# EAGLE schematic DUINOMITE-eMEGA_Rev_B1 (EAGLE 4.16)
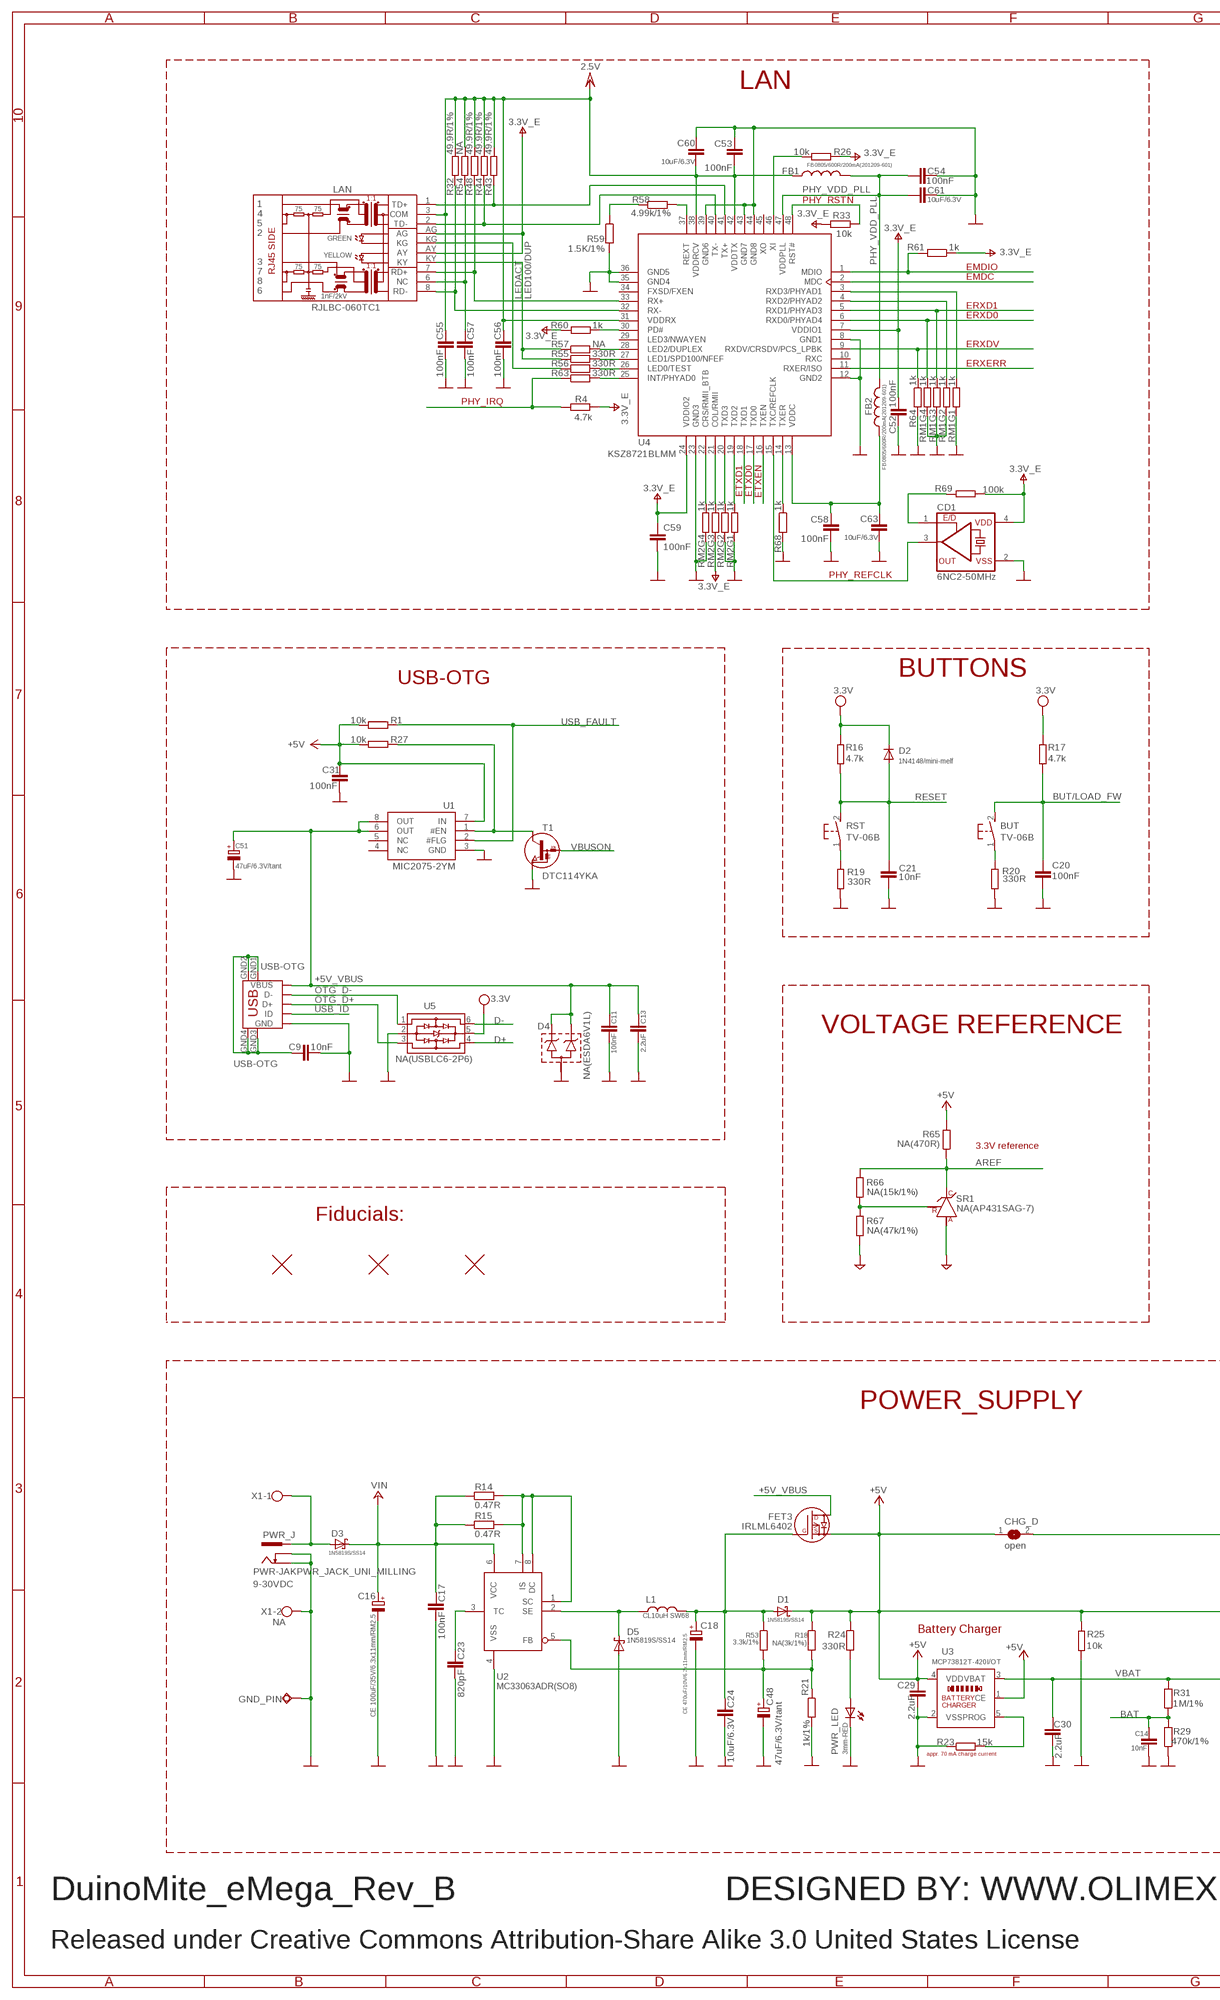
[diagram p0: schematic, sheet 1, part 1 of 2]
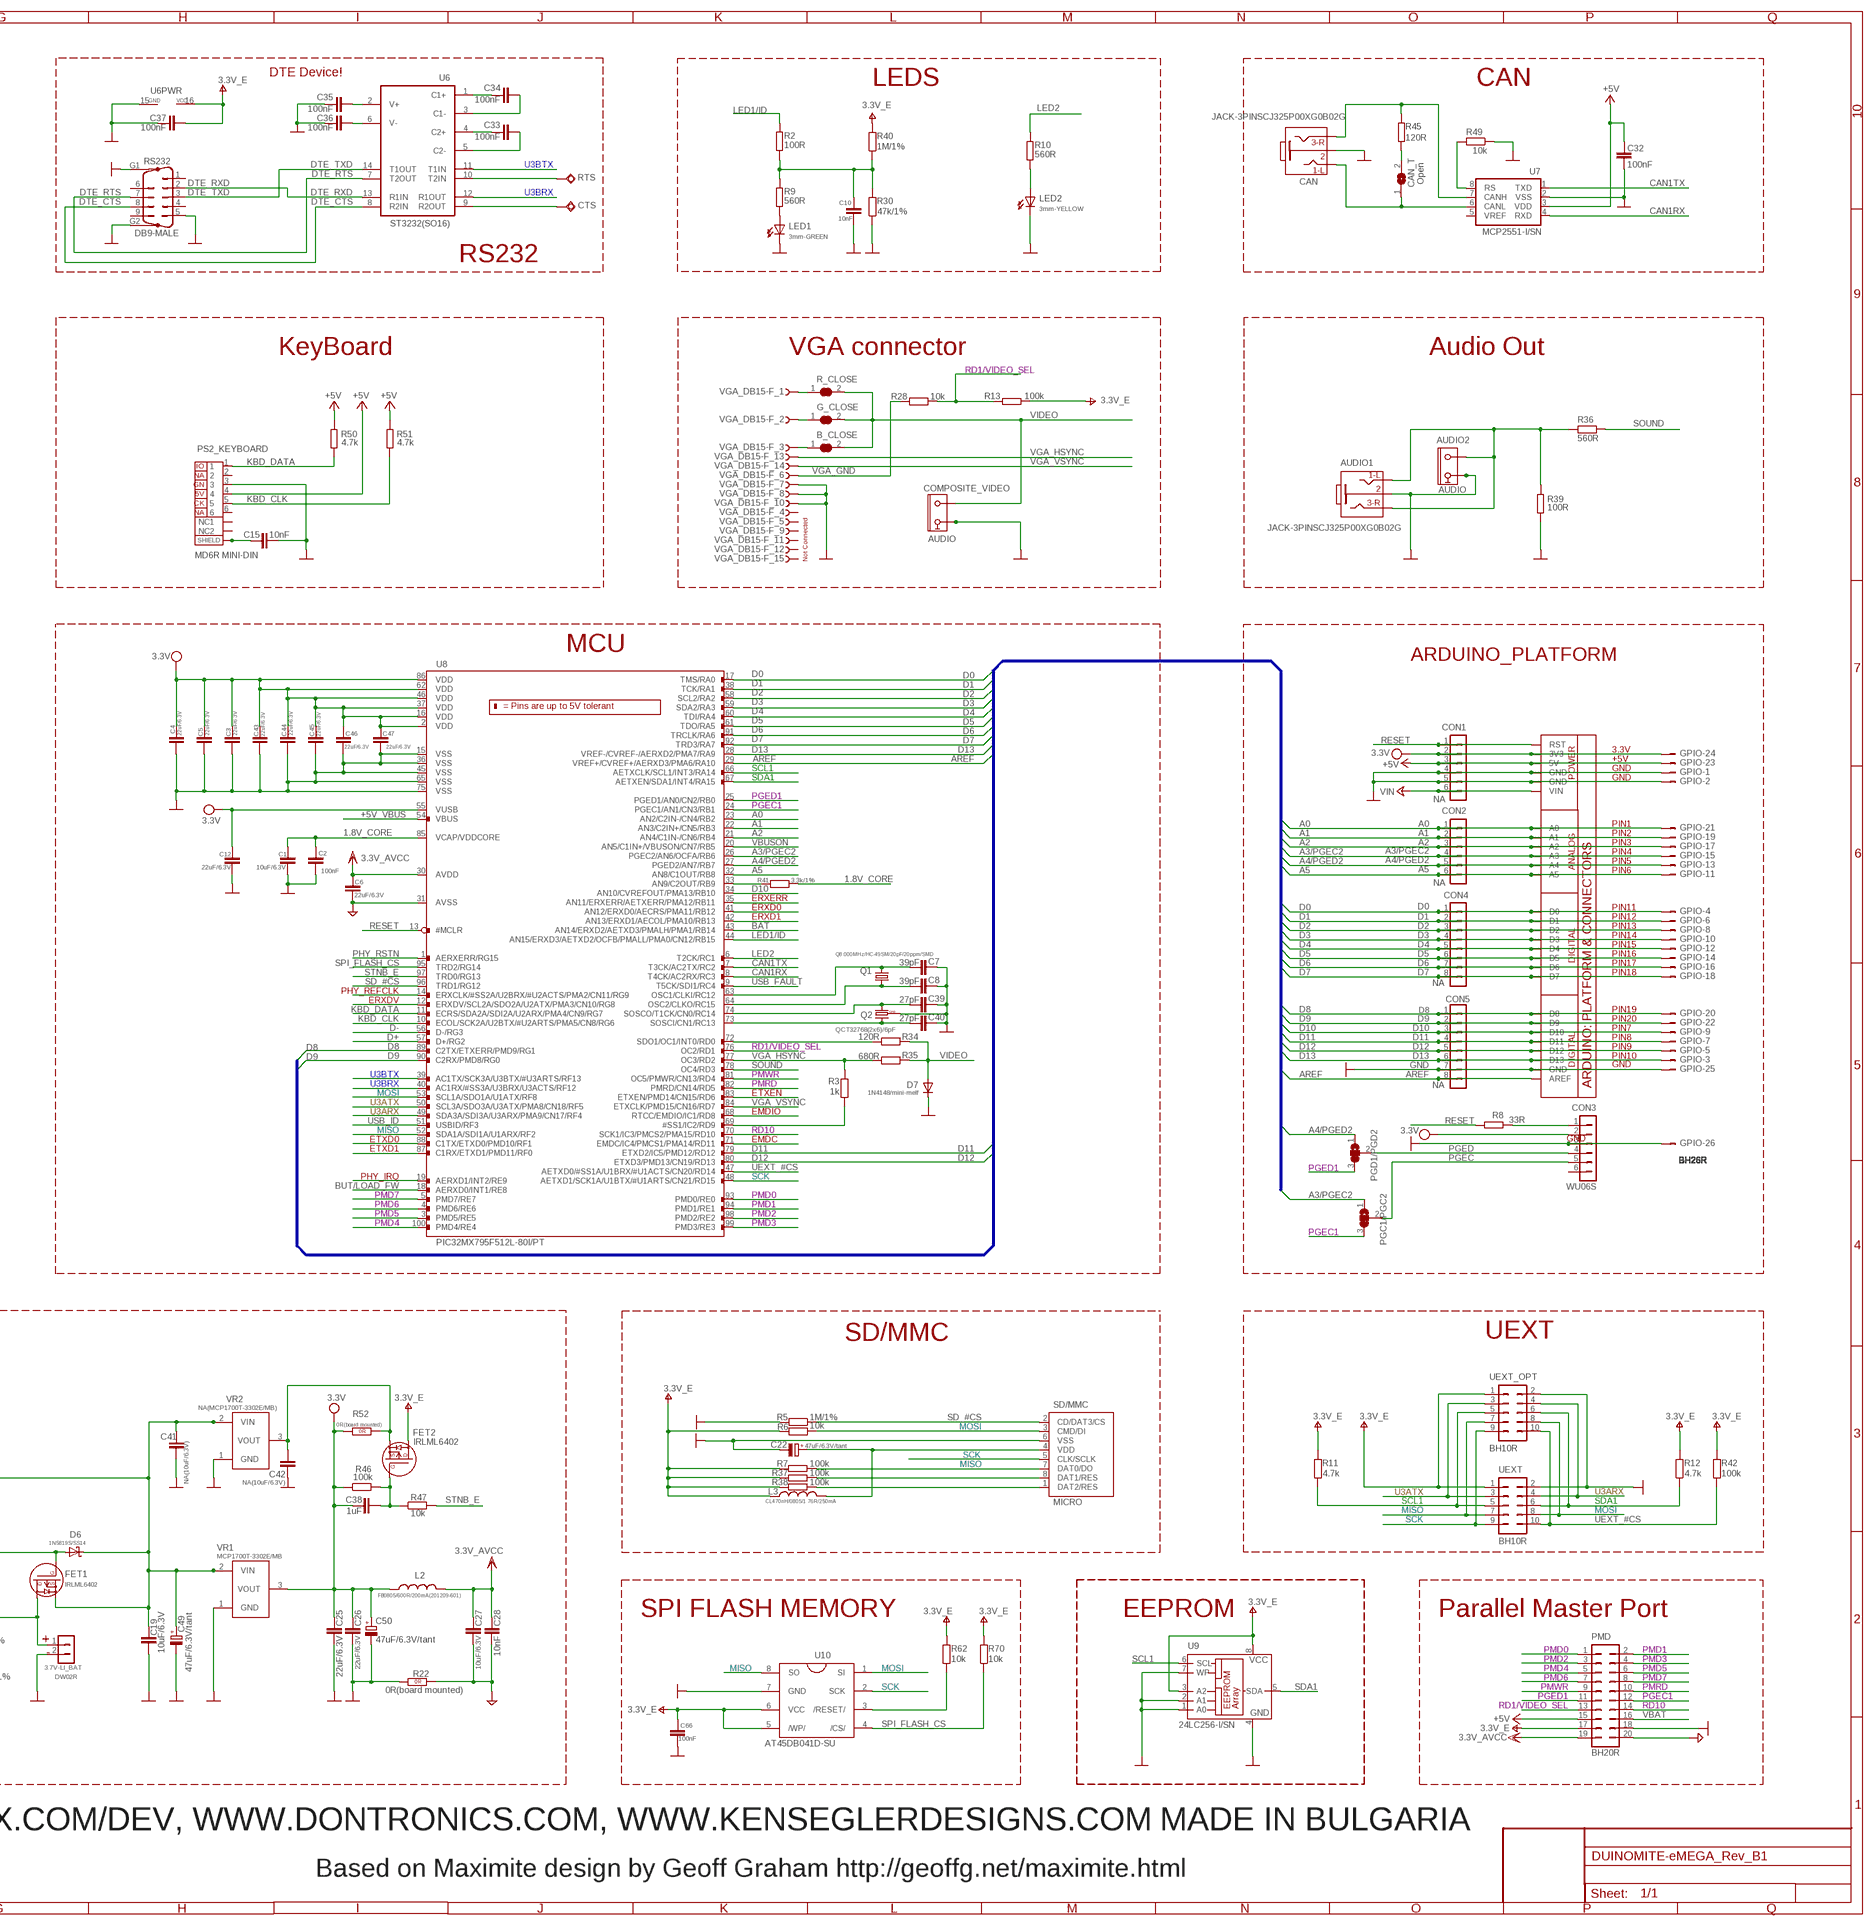
[diagram p1: schematic, sheet 1, part 2 of 2]

## Parts
3.7V-LI_BAT  DW02R  CON2DW02R  [DW02R]
AUDIO1  JACK-3PINSCJ325P00XG0B02G  [PHONE_JACK-SMD]
AUDIO2  AUDIO  VIDEO_CINCH  [VIDEO_CINCH]
B_CLOSE  SJSJ_1_SMALLER_CLOSE  [SJ_1_SMALLER_CLOSE]
BUT  TV-06B  31-XX  [B3F-31XX]
C1  10uF/6.3V  C-EUC0603_DWS  [C0603_DWS]
C2  100nF  C-EUC0603_DWS  [C0603_DWS]
C3  22uF/6.3V  C-EUC0603_DWS  [C0603_DWS]
C4  22uF/6.3V  C-EUC0603_DWS  [C0603_DWS]
C5  22uF/6.3V  C-EUC0603_DWS  [C0603_DWS]
C6  22uF/6.3V  C-EUC0603_DWS  [C0603_DWS]
C7  39pF  C-EUC0603_DWS  [C0603_DWS]
C8  39pF  C-EUC0603_DWS  [C0603_DWS]
C9  10nF  C-EUC0603_DWS  [C0603_DWS]
C10  10nF  C-EUC0603_DWS  [C0603_DWS]
C11  100nF  C-EUC0603_DWS  [C0603_DWS]
C12  22uF/6.3V  C-EUC0603_DWS  [C0603_DWS]
C13  2.2uF  C-EUC0603_DWS  [C0603_DWS]
C14  10nF  C-EUC0603_DWS  [C0603_DWS]
C15  10nF  C-EUC0603_DWS  [C0603_DWS]
C16  CE 100uF/35V/6.3x11mm/RM2.5  CPOL-EUE2.5-6.3  [E2,5-6,3]
C17  100nF  C-EUC0603_DWS  [C0603_DWS]
C18  CE 470uF/10V/6.3x11mm/RM2.5  CPOL-EUE2.5-6.3  [E2,5-6,3]
C19  10uF/6.3V  C-EUC0603_DWS  [C0603_DWS]
C20  100nF  C-EUC0603_DWS  [C0603_DWS]
C21  10nF  C-EUC0603_DWS  [C0603_DWS]
C22  47uF/6.3V/tant  CPOL-EUCT3528  [CT3528]
C23  820pF  C-EUC0603_DWS  [C0603_DWS]
C24  10uF/6.3V  C-EUC0603_DWS  [C0603_DWS]
C25  22uF/6.3V  C-EUC0603_DWS  [C0603_DWS]
C26  22uF/6.3V  C-EUC0603_DWS  [C0603_DWS]
C27  10uF/6.3V  C-EUC0603_DWS  [C0603_DWS]
C28  10nF  C-EUC0603_DWS  [C0603_DWS]
C29  2.2uF  C-EUC0603_DWS  [C0603_DWS]
C30  2.2uF  C-EUC0603_DWS  [C0603_DWS]
C31  100nF  C-EUC0603_DWS  [C0603_DWS]
C32  100nF  C-EUC0603_DWS  [C0603_DWS]
C33  100nF  C-EUC0603_DWS  [C0603_DWS]
C34  100nF  C-EUC0603_DWS  [C0603_DWS]
C35  100nF  C-EUC0603_DWS  [C0603_DWS]
C36  100nF  C-EUC0603_DWS  [C0603_DWS]
C37  100nF  C-EUC0603_DWS  [C0603_DWS]
C38  1uF  C-EUC0603_DWS  [C0603_DWS]
C39  27pF  C-EUC0603_DWS  [C0603_DWS]
C40  27pF  C-EUC0603_DWS  [C0603_DWS]
C41  NA(10uF/6.3V)  C-EUC0603_DWS_NA  [C0603_DWS_NA]
C42  NA(10uF/6.3V)  C-EUC0603_DWS_NA  [C0603_DWS_NA]
C43  22uF/6.3V  C-EUC0603_DWS  [C0603_DWS]
C44  22uF/6.3V  C-EUC0603_DWS  [C0603_DWS]
C45  22uF/6.3V  C-EUC0603_DWS  [C0603_DWS]
C46  22uF/6.3V  C-EUC0603_DWS  [C0603_DWS]
C47  22uF/6.3V  C-EUC0603_DWS  [C0603_DWS]
C48  47uF/6.3V/tant  CPOL-EUCT3528  [CT3528]
C49  47uF/6.3V/tant  CPOL-EUCT3528  [CT3528]
C50  47uF/6.3V/tant  CPOL-EUCT3528  [CT3528]
C51  47uF/6.3V/tant  CPOL-EUCT3528  [CT3528]
C52  100nF  C-EUC0603_DWS  [C0603_DWS]
C53  100nF  C-EUC0603_DWS  [C0603_DWS]
C54  100nF  C-EUC0603_DWS  [C0603_DWS]
C55  100nF  C-EUC0603_DWS  [C0603_DWS]
C56  100nF  C-EUC0603_DWS  [C0603_DWS]
C57  100nF  C-EUC0603_DWS  [C0603_DWS]
C58  100nF  C-EUC0603_DWS  [C0603_DWS]
C59  100nF  C-EUC0603_DWS  [C0603_DWS]
C60  10uF/6.3V  C-EUC0603_DWS  [C0603_DWS]
C61  10uF/6.3V  C-EUC0603_DWS  [C0603_DWS]
C63  10uF/6.3V  C-EUC0603_DWS  [C0603_DWS]
C66  100nF  C-EUC0603_DWS  [C0603_DWS]
CAN  JACK-3PINSCJ325P00XG0B02G  [PHONE_JACK-SMD]
CAN_T  Open  SJ  [SJ]
CD1  6NC2-50MHz  6NC2_CLOCK_DRIVER  [7X5MM_CLOCK_DRIVER]
CHG_D  open  SJ  [SJ]
COMPOSITE_VIDEO  AUDIO  VIDEO_CINCH  [VIDEO_CINCH]
CON1  NA  CON6PN1X6  [PN1X6]
CON2  NA  CON6PN1X6  [PN1X6]
CON3  WU06S  CON6  [CON1.27MM-6-SMALL_ICSP]
CON4  NA  CON8PN1X8  [PN1X8]
CON5  NA  CON8PN1X8  [PN1X8]
CTS  TESTPAD3  [TEST_PAD40/70/SQUARE]
D1  1N5819S/SS14  SCHOTKKY7.62SS2  [MLL-41]
D2  1N4148/mini-melf  DSMD  [MINI-MELF]
D3  1N5819S/SS14  SCHOTKKY7.62SS2  [MLL-41]
D4  NA(ESDA6V1L)  MMBZ5V6ALT1  [SOT-23]
D5  1N5819S/SS14  SCHOTKKY7.62SS2  [MLL-41]
D6  1N5819S/SS14  SCHOTKKY7.62SS2  [MLL-41]
D7  1N4148/mini-melf  DSMD  [MINI-MELF]
FB1  FB0805/600R/200mA(201209-601)  L-USL0805_5MIL_DWS  [L0805_5MIL_DWS]
FB2  FB0805/600R/200mA(201209-601)  L-USL0805_5MIL_DWS  [L0805_5MIL_DWS]
FET1  IRLML6402  P-MOS+DIODIRLML6402  [SOT23]
FET2  IRLML6402  P-MOS+DIODIRLML6402  [SOT23]
FET3  IRLML6402  P-MOS+DIODIRLML6402  [SOT23]
FID1  FIDUCIAL1X2  [FIDUCIAL-1X2]
FID2  FIDUCIAL1X2  [FIDUCIAL-1X2]
FID3  FIDUCIAL1X2  [FIDUCIAL-1X2]
G_CLOSE  SJSJ_1_SMALLER_CLOSE  [SJ_1_SMALLER_CLOSE]
GND_PIN  TESTPAD3  [TEST_PAD40/70/SQUARE]
GPIO  BH26R  ML26RE  [BH26R]
L1  CL10uH SW68  LSW68  [SW68]
L2  FB0805/600R/200mA(201209-601)  L-USL0805_5MIL_DWS  [L0805_5MIL_DWS]
L3  CL470nH/0805/1.76R/250mA  L-USL0805_5MIL_DWS  [L0805_5MIL_DWS]
LAN  RJLBC-060TC1  [RJLBC-060TC1]
LED1  3mm-GREEN  LED3.0MM  [LED-3.0MM]
LED2  3mm-YELLOW  LED3.0MM  [LED-3.0MM]
PGC1/PGC2  SJ2W5  [SJ_2_SMALL_23_TIED]
PGD1/PGD2  SJ2W5  [SJ_2_SMALL_23_TIED]
PMD  BH20R  ML20L  [ML20L]
PS2_KEYBOARD  MD6R MINI-DIN  PS2PS2  [PS2]
PWR_J  PWR-JAKPWR_JACK_UNI_MILLING  [PWR_JACK_UNI_MILLING]
PWR_LED  3mm-RED  LED3.0MM  [LED-3.0MM]
Q1  Q8.000MHz/HC-49SM/20pF/20ppm/SMD  HC49/S1  [HC49/SMD2_THIN]
Q2  QCT32768(2x6)/6pF  Q_GND1  [TC26H_3_REPAIR_SMD]
R1  10k  R-EU_R0603_5MIL_DWS  [R0603_5MIL_DWS]
R2  100R  R-EU_R0603_5MIL_DWS  [R0603_5MIL_DWS]
R3  1k  R-EU_R0603MM  [R0603MM]
R4  4.7k  R-EU_R0603_5MIL_DWS  [R0603_5MIL_DWS]
R5  1M/1%  R-EU_R0603_5MIL_DWS  [R0603_5MIL_DWS]
R6  10k  R-EU_R0603_5MIL_DWS  [R0603_5MIL_DWS]
R7  100k  R-EU_R0603_5MIL_DWS  [R0603_5MIL_DWS]
R8  33R  R-EU_R0603_5MIL_DWS  [R0603_5MIL_DWS]
R9  560R  R-EU_R0603_5MIL_DWS  [R0603_5MIL_DWS]
R10  560R  R-EU_R0603_5MIL_DWS  [R0603_5MIL_DWS]
R11  4.7k  R-EU_R0603_5MIL_DWS  [R0603_5MIL_DWS]
R12  4.7k  R-EU_R0603_5MIL_DWS  [R0603_5MIL_DWS]
R13  100k  R-EU_R0603_5MIL_DWS  [R0603_5MIL_DWS]
R14  0.47R  R-EU_R1206_5MIL_WS  [R1206_5MIL_WS]
R15  0.47R  R-EU_R1206_5MIL_WS  [R1206_5MIL_WS]
R16  4.7k  R-EU_R0603_5MIL_DWS  [R0603_5MIL_DWS]
R17  4.7k  R-EU_R0603_5MIL_DWS  [R0603_5MIL_DWS]
R18  NA(3k/1%)  R-EU_R0603_5MIL_DWS  [R0603_5MIL_DWS]
R19  330R  R-EU_R0603_5MIL_DWS  [R0603_5MIL_DWS]
R20  330R  R-EU_R0603_5MIL_DWS  [R0603_5MIL_DWS]
R21  1k/1%  R-EU_R0603_5MIL_DWS  [R0603_5MIL_DWS]
R22  0R(board mounted)  R_0R0R(NA)  [0603_0R]
R23  15k  R-EU_R0603_5MIL_DWS  [R0603_5MIL_DWS]
R24  330R  R-EU_R0603_5MIL_DWS  [R0603_5MIL_DWS]
R25  10k  R-EU_R0603_5MIL_DWS  [R0603_5MIL_DWS]
R26  10k  R-EU_R0603_5MIL_DWS  [R0603_5MIL_DWS]
R27  10k  R-EU_R0603_5MIL_DWS  [R0603_5MIL_DWS]
R28  10k  R-EU_R0603_5MIL_DWS  [R0603_5MIL_DWS]
R29  470k/1%  R-EU_R0603_5MIL_DWS  [R0603_5MIL_DWS]
R30  47k/1%  R-EU_R0603_5MIL_DWS  [R0603_5MIL_DWS]
R31  1M/1%  R-EU_R0603_5MIL_DWS  [R0603_5MIL_DWS]
R32  49.9R/1%  R-EU_R0603_5MIL_DWS  [R0603_5MIL_DWS]
R33  10k  R-EU_R0603_5MIL_DWS  [R0603_5MIL_DWS]
R34  120R  R-EU_R1206_5MIL_WS  [R1206_5MIL_WS]
R35  680R  R-EU_R0603_5MIL_DWS  [R0603_5MIL_DWS]
R36  560R  R-EU_R0603_5MIL_DWS  [R0603_5MIL_DWS]
R37  100k  R-EU_R0603_5MIL_DWS  [R0603_5MIL_DWS]
R38  100k  R-EU_R0603_5MIL_DWS  [R0603_5MIL_DWS]
R39  100R  R-EU_R0603_5MIL_DWS  [R0603_5MIL_DWS]
R40  1M/1%  R-EU_R0603_5MIL_DWS  [R0603_5MIL_DWS]
R41  3.3k/1%  R-EU_R0603_5MIL_DWS  [R0603_5MIL_DWS]
R42  100k  R-EU_R0603_5MIL_DWS  [R0603_5MIL_DWS]
R43  49.9R/1%  R-EU_R0603_5MIL_DWS  [R0603_5MIL_DWS]
R44  49.9R/1%  R-EU_R0603_5MIL_DWS  [R0603_5MIL_DWS]
R45  120R  R-EU_R1206_5MIL_WS  [R1206_5MIL_WS]
R46  100k  R-EU_R0603_5MIL_DWS  [R0603_5MIL_DWS]
R47  10k  R-EU_R0603_5MIL_DWS  [R0603_5MIL_DWS]
R48  49.9R/1%  R-EU_R0603_5MIL_DWS  [R0603_5MIL_DWS]
R49  10k  R-EU_R0603_5MIL_DWS  [R0603_5MIL_DWS]
R50  4.7k  R-EU_R0603_5MIL_DWS  [R0603_5MIL_DWS]
R51  4.7k  R-EU_R0603_5MIL_DWS  [R0603_5MIL_DWS]
R52  0R(board mounted)  R_0R0R(NA)  [0603_0R]
R53  3.3k/1%  R-EU_R0603_5MIL_DWS  [R0603_5MIL_DWS]
R54  NA  R-EU_R0603_5MIL_DWS  [R0603_5MIL_DWS]
R55  330R  R-EU_R0603_5MIL_DWS  [R0603_5MIL_DWS]
R56  330R  R-EU_R0603_5MIL_DWS  [R0603_5MIL_DWS]
R57  NA  R-EU_R0603_5MIL_DWS_NA  [R0603_5MIL_DWS_NA]
R58  4.99k/1%  R-EU_R0603_5MIL_DWS  [R0603_5MIL_DWS]
R59  1.5K/1%  R-EU_R0603_5MIL_DWS  [R0603_5MIL_DWS]
R60  1k  R-EU_R0603_5MIL_DWS  [R0603_5MIL_DWS]
R61  1k  R-EU_R0603_5MIL_DWS  [R0603_5MIL_DWS]
R62  10k  R-EU_R0603_5MIL_DWS  [R0603_5MIL_DWS]
R63  330R  R-EU_R0603_5MIL_DWS  [R0603_5MIL_DWS]
R64  1k  R-EU_R0603_5MIL_DWS  [R0603_5MIL_DWS]
R65  NA(470R)  R-EU_R0603_5MIL_DWS_NA  [R0603_5MIL_DWS_NA]
R66  NA(15k/1%)  R-EU_R0603_5MIL_DWS_NA  [R0603_5MIL_DWS_NA]
R67  NA(47k/1%)  R-EU_R0603_5MIL_DWS_NA  [R0603_5MIL_DWS_NA]
R68  1k  R-EU_R0603_5MIL_DWS  [R0603_5MIL_DWS]
R69  100k  R-EU_R0603_5MIL_DWS  [R0603_5MIL_DWS]
R70  10k  R-EU_R0603_5MIL_DWS  [R0603_5MIL_DWS]
R_CLOSE  SJSJ_1_SMALLER_CLOSE  [SJ_1_SMALLER_CLOSE]
RM1  1k  R_MATRIX_4E  [R_MATRIX_4]
RM2  1k  R_MATRIX_4E  [R_MATRIX_4]
RS232  DB9-MALE  M09HP_DB9-BMR  [DB9-BMR]
RST  TV-06B  31-XX  [B3F-31XX]
RTS  TESTPAD3  [TEST_PAD40/70/SQUARE]
SD/MMC  MICRO  MICRO_SD/MMC  [TFR-MEM-CON]
SR1  NA(AP431SAG-7)  TL431'''  [SOT-23]
T1  DTC114YKA  DIGITAL_TRANSISTORS-NPNDTC114YKA  [SOT-23]
U1  MIC2075-2YM  MIC2075  [SOIC8]
U2  MC33063ADR(SO8)  MC34063A_OFF  [SO-8_TRM]
U3  MCP73812T-420I/OT  MCP7381XSOT-23-5  [SOT-23-5]
U4  KSZ8721BLMM  KS8721BLMM  [LQFP48_MM]
U5  NA(USBLC6-2P6)  USBLC6-2  [USBLC6-2P6]
U6  ST3232(SO16)  MAX32321  [SO16-150MIL-THIN_PADS]
U7  MCP2551-I/SN  MCP2551  [SO-08]
U8  PIC32MX795F512L-80I/PT  [PTQFP100]
U9  24LC256-I/SN  24LCXX  [SO-08MN]
U10  AT45DB041D-SU  AT45DB041B_1  [AT45DB041B_1]
U11  3x(PN1x8)+1x(PN1x6)  PIC_PLATFORM_WITHOUT_ICSP  [PIC_PLATFORM_MAXMITE_WITHOUT_DIMENSION_LAYER__ICSP]
UEXT  BH10R  ML10R  [BH10R]
UEXT_OPT  BH10R  ML10R  [BH10R]
USB-OTG  USB-OTG  MINI_USB9  [USB_MINI_9PIN]
VGA_DB15-F  VGA15  DB1522  [DB15-F_22MM]
VR1  MCP1700T-3302E/MB  MCP1700-REP1  [SOT89_REP_THERMALOFF]
VR2  NA(MCP1700T-3302E/MB)  MCP1700-REP1  [SOT89_REP_THERMALOFF]
X1  NA  W237-102  [W237-102]

## Nets
1.8V_CORE: C1.1 C2.1 R41.1 U8.85(VCAP/VDDCORE)
+5V: C29.1 C31.1 C32.1 CHG_D.1 CON1.3 D1.K(C) D6.A FET1.1(G) FET3.2(S) GPIO.23 PMD.15 PS2_KEYBOARD.4 R1.2 R18.1 R24.1 R25.1 R27.2 R50.1 R51.1 R65.2 U1.7(IN) U3.1(CE) U3.4(VDD) U7.3(VDD) U11.5V
+5V_VBUS [pwr]: C11.2 C13.1 C51.+ D4.1 D4.2 FET3.3(D) U1.6(OUT) U1.8(OUT) U8.54(VBUS) USB-OTG.VBUS
+24V: C16.+ C17.1 CON1.6 D3.K(C) R14.1 R15.1 U2.6(VCC) U11.VIN ; supply symbol labelled VIN
A0: CON2.1 GPIO.21 U8.23(AN2/C2IN-/CN4/RB2) U11.A0
A1: CON2.2 GPIO.19 U8.22(AN3/C2IN+/CN5/RB3) U11.A1
A2: CON2.3 GPIO.17 U8.21(AN4/C1IN-/CN6/RB4) U11.A2
A3/PGEC2: CON2.4 GPIO.15 PGC1/PGC2.1 U8.26(PGEC2/AN6/OCFA/RB6) U11.A3
A4/PGED2: CON2.5 GPIO.13 PGD1/PGD2.1 U8.27(PGED2/AN7/RB7) U11.A4
A5: CON2.6 GPIO.11 U8.32(AN8/C1OUT/RB8) U11.A5
AGND: C6.2 C27.2 C28.2 PMD.20 R22.2(1.2) R67.1 SR1.3(A) U8.31(AVSS)
AREF: CON5.8 R65.1 R66.2 SR1.1(C) U8.29(VREF+/CVREF+/AERXD3/PMA6/RA10) U11.AREF
BAT: C14.2 R29.2 R31.1 U8.43(AN14/ERXD2/AETXD3/PMALH/PMA1/RB14)
BUT/LOAD_FW: BUT.2(S) C20.1 R17.2 U8.18(AERXD0/INT1/RE8)
CAN1RX: U7.4(RXD) U8.8(T4CK/AC2RX/RC3)
CAN1TX: U7.1(TXD) U8.7(T3CK/AC2TX/RC2)
CANH: CAN.2 R45.2 U7.7(CANH)
CANL: CAN.5 CAN_T.1 U7.6(CANL)
D0: CON4.1 GPIO.4 U8.17(TMS/RA0) U11.D0
D1: CON4.2 GPIO.6 U8.38(TCK/RA1) U11.D1
D2: CON4.3 GPIO.8 U8.58(SCL2/RA2) U11.D2
D3: CON4.4 GPIO.10 U8.59(SDA2/RA3) U11.D3
D4: CON4.5 GPIO.12 U8.60(TDI/RA4) U11.D4
D5: CON4.6 GPIO.14 U8.61(TDO/RA5) U11.D5
D6: CON4.7 GPIO.16 U8.91(TRCLK/RA6) U11.D6
D7: CON4.8 GPIO.18 U8.92(TRD3/RA7) U11.D7
D8: CON5.1 GPIO.20 U8.89(C2TX/ETXERR/PMD9/RG1) U11.D8
D9: CON5.2 GPIO.22 U8.90(C2RX/PMD8/RG0) U11.D9
D10: CON5.3 GPIO.9 U8.34(AN10/CVREFOUT/PMA13/RB10) U11.D10
D11: CON5.4 GPIO.7 U8.79(ETXD2/IC5/PMD12/RD12) U11.D11
D12: CON5.5 GPIO.5 U8.80(ETXD3/PMD13/CN19/RD13) U11.D12
D13: CON5.6 GPIO.3 U8.28(VREF-/CVREF-/AERXD2/PMA7/RA9) U11.D13
D+: U5.4 U8.57(D+/RG2)
D-: U5.6 U8.56(D-/RG3)
DTE_CTS: RS232.8 U6.8(R2IN)
DTE_RTS: RS232.7 U6.7(T2OUT)
DTE_RXD: RS232.2 U6.13(R1IN)
DTE_TXD: RS232.3 U6.14(T1OUT)
EMDC: U4.2(MDC) U8.71(EMDC/IC4/PMCS1/PMA14/RD11)
EMDIO: R61.2 U4.1(MDIO) U8.68(RTCC/EMDIO/IC1/RD8)
ERXD0: RM1.4.2 U4.6(RXD0/PHYAD4) U8.41(AN12/ERXD0/AECRS/PMA11/RB12)
ERXD1: RM1.3.2 U4.5(RXD1/PHYAD3) U8.42(AN13/ERXD1/AECOL/PMA10/RB13)
ERXDV: R64.1 U4.9(RXDV/CRSDV/PCS_LPBK) U8.12(ERXDV/SCL2A/SDO2A/U2ATX/PMA3/CN10/RG8)
ERXERR: U4.11(RXER/ISO) U8.35(AN11/ERXERR/AETXERR/PMA12/RB11)
ETXD0: U4.17(TXD0) U8.88(C1TX/ETXD0/PMD10/RF1)
ETXD1: U4.18(TXD1) U8.87(C1RX/ETXD1/PMD11/RF0)
ETXEN: U4.16(TXEN) U8.83(ETXEN/PMD14/CN15/RD6)
GND [pwr]: 3.7V-LI_BAT.2 AUDIO1.1 AUDIO2.GND1(GND) AUDIO2.GND1A(GND) AUDIO2.GND1B(GND) AUDIO2.GND1C(GND) AUDIO2.GND1D(GND) AUDIO2.GND1E(GND) AUDIO2.GND2(GND) AUDIO2.GND3(GND) AUDIO2.GND3C(GND) AUDIO2.GND3D(GND) AUDIO2.GND3E(GND) AUDIO2.GNG3A(GND) AUDIO2.GNG3B(GND) C1.2 C2.2 C3.2 C4.2 C5.2 C7.1 C8.1 C9.1 C10.1 C11.1 C12.1 C13.2 C14.1 C15.2 C16.- C17.2 C18.- C19.2 C20.2 C21.2 C22.- C23.2 C24.2 C25.2 C26.2 C29.2 C30.2 C31.2 C32.2 C35.2 C36.2 C37.2 C39.1 C40.1 C41.2 C42.2 C43.2 C44.2 C45.2 C46.2 C47.2 C48.- C49.- C50.- C51.- C52.2 C53.1 C54.2 C55.2 C56.2 C57.1 C58.2 C59.2 C60.1 C61.2 C63.2 C66.1 CAN.1 CD1.2(VSS) COMPOSITE_VIDEO.GND1(GND) COMPOSITE_VIDEO.GND1A(GND) COMPOSITE_VIDEO.GND1B(GND) COMPOSITE_VIDEO.GND1C(GND) COMPOSITE_VIDEO.GND1D(GND) COMPOSITE_VIDEO.GND1E(GND) COMPOSITE_VIDEO.GND2(GND) COMPOSITE_VIDEO.GND3(GND) COMPOSITE_VIDEO.GND3C(GND) COMPOSITE_VIDEO.GND3D(GND) COMPOSITE_VIDEO.GND3E(GND) COMPOSITE_VIDEO.GNG3A(GND) COMPOSITE_VIDEO.GNG3B(GND) CON1.4 CON1.5 CON3.3 CON5.7 D4.3 D5.A D7.C(K) GND_PIN.P$1(PP) GPIO.1 GPIO.2 GPIO.25 GPIO.26 LED1.K(C) LED2.K(C) PMD.18 PS2_KEYBOARD.3 PWR_J.- PWR_J.-- PWR_LED.K(C) Q2.GND R5.2 R19.1 R20.1 R21.2 R22.1(1.1) R23.1 R25.2 R29.1 R30.1 R39.2 R49.1 R59.2 R64.2 R68.2 RM1.1.1 RM1.2.1 RM1.3.1 RM1.4.1 RM2.1.1 RM2.2.1 RM2.4.1 RS232.5 RS232.G1 RS232.G2 SD/MMC.6(VSS) T1.2(E) U1.3(GND) U2.4(VSS) U3.2(VSS) U4.8(GND1) U4.12(GND2) U4.23(GND3) U4.35(GND4) U4.36(GND5) U4.39(GND6) U4.43(GND7) U4.44(GND8) U5.2 U6.15(GND) U7.2(VSS) U8.15(VSS) U8.36(VSS) U8.45(VSS) U8.65(VSS) U8.75(VSS) U9.1(A0) U9.2(A1) U9.4(GND) U9.7(WP) U10.7(GND) U11.GND U11.GND@1(GND) U11.GND@2(GND) UEXT.2 UEXT_OPT.2 USB-OTG.GND VGA_DB15-F.7 VGA_DB15-F.8 VGA_DB15-F.10 VR1.1(GND) VR2.1(GND) X1.2
KBD_CLK: PS2_KEYBOARD.5 R51.2 U8.10(ECOL/SCK2A/U2BTX/#U2ARTS/PMA5/CN8/RG6)
KBD_DATA: PS2_KEYBOARD.1 R50.2 U8.11(ECRS/SDA2A/SDI2A/U2ARX/PMA4/CN9/RG7)
LED1/ID: R2.2 U8.44(AN15/ERXD3/AETXD2/OCFB/PMALL/PMA0/CN12/RB15)
LED2: R10.2 U8.6(T2CK/RC1)
LED100/DUP: LAN.KY R55.1 R57.1
LEDACT: LAN.KG R56.1
MCIDAT1: R37.1 SD/MMC.8(DAT1/RES)
MCIDAT2: R38.1 SD/MMC.1(DAT2/RES)
MISO: R7.1 SD/MMC.7(DAT0/DO) U8.52(SDA1A/SDI1A/U1ARX/RF2) U10.8(SO) UEXT.7 UEXT_OPT.7
MOSI: R6.1 SD/MMC.3(CMD/DI) U8.53(SCL1A/SDO1A/U1ATX/RF8) U10.1(SI) UEXT.8 UEXT_OPT.8
N$1: C18.+ C24.1 D1.A FET3.1(G) L1.2 R53.1
N$2: C39.2 Q2.1 U8.74(SOSCO/T1CK/CN0/RC14)
N$3: BUT.1(P) R20.2
N$4: CON3.1 R8.1
N$5: LED2.A R10.1
N$6: R27.1 T1.3(C) U1.1(#EN)
N$7: C42.1 FET2.2(S) R52.2(1.2) VR2.3(VOUT)
N$8: PWR_LED.A R24.2
N$9: RTS.P$1(PP) U6.10(T2IN)
N$10: CTS.P$1(PP) U6.9(R2OUT)
N$11: R19.2 RST.1(P)
N$12: C38.2 FET2.1(G) R46.2 R47.1
N$13: R49.2 U7.8(RS)
N$14: R41.2 U8.33(AN9/C2OUT/RB9)
N$15: AUDIO1.2 AUDIO1.5 AUDIO2.IO R36.2 R39.1
N$16: R57.2 U4.28(LED2/DUPLEX)
N$17: C7.2 Q1.2 U8.63(OSC1/CLKI/RC12)
N$18: R34.1 U8.72(SDO1/OC1/INT0/RD0)
N$19: C8.2 Q1.1 U8.64(OSC2/CLKO/RC15)
N$20: RM2.4.2 U4.22(CRS/RMII_BTB)
N$21: RM2.1.2 U4.19(TXD2)
N$22: R23.2 U3.5(PROG)
N$23: LED1.A R9.1
N$24: R3.1 U8.69(#SS1/IC2/RD9)
N$25: C10.2 R2.1 R9.2 R30.2 R40.1
N$26: R_CLOSE.1 VGA_DB15-F.1
N$27: R66.1 R67.2 SR1.2(R)
N$28: C40.2 Q2.2 U8.73(SOSCI/CN1/RC13)
N$29: RM2.2.2 U4.20(TXD3)
N$30: RM2.3.2 U4.21(COL/RMII)
N$31: C34.1 U6.3(C1-)
N$32: G_CLOSE.1 VGA_DB15-F.2
N$33: C23.1 U2.3(TC)
N$34: C19.1 C41.1 C49.+ CHG_D.2 D6.K(C) FET1.2(S) VR1.2(VIN) VR1.P$2(VIN1) VR2.2(VIN) VR2.P$2(VIN1)
N$35: B_CLOSE.1 VGA_DB15-F.3
N$37: R62.1 U10.3(/RESET/)
N$44: C33.1 U6.5(C2-)
N$45: C34.2 U6.1(C1+)
N$46: C33.2 U6.4(C2+)
N$47: C36.1 U6.6(V-)
N$48: C35.1 U6.2(V+)
N$61: C48.+ R18.2 R21.1 R53.2 U2.5(FB)
N$64: R14.2 R15.2 U2.1(SC) U2.7(IS) U2.8(DC)
N$67 [pwr]: D5.K(C) L1.1 U2.2(SE)
N$70: R58.1 R59.1
N$71: R58.2 U4.37(REXT)
N$72: C58.1 C63.1 FB2.2 U4.13(VDDC)
N$73: R26.2 U4.46(XI)
N$74: CD1.1(E/D) R69.2
N$75: CAN_T.2 R45.1
N$78: LAN.2(TD-) R44.1 U4.40(TX-)
N$80: LAN.1(TD+) R43.1 U4.41(TX+)
N$81: LAN.7(RD+) R48.1 U4.33(RX+)
N$82: LAN.8(RD-) R32.1 U4.32(RX-)
N$83: R55.2 U4.27(LED1/SPD100/NFEF)
N$84: R56.2 U4.26(LED0/TEST)
N$85: R60.2 U4.30(PD#)
N$86: C15.1 PS2_KEYBOARD.SHIELD1 PS2_KEYBOARD.SHIELD2 PS2_KEYBOARD.SHIELD3
N$88: C57.2 LAN.6(NC) R54.1
N$89: RM1.2.2 U4.4(RXD2/PHYAD2)
N$90: RM1.1.2 U4.3(RXD3/PHYAD1)
N$91: R68.1 U4.14(TXER)
N$92: R63.2 U4.25(INT/PHYAD0)
N$116: C22.+ L3.2 SD/MMC.4(VDD)
OTG_D+: U5.3 USB-OTG.D+
OTG_D-: U5.1 USB-OTG.D-
PGEC: CON3.5 PGC1/PGC2.2
PGEC1: PGC1/PGC2.3 PMD.12 U8.24(PGEC1/AN1/CN3/RB1)
PGED: CON3.4 PGD1/PGD2.2
PGED1: PGD1/PGD2.3 PMD.11 U8.25(PGED1/AN0/CN2/RB0)
PHY_IRQ: R4.2 R63.1 U8.19(AERXD1/INT2/RE9)
PHY_REFCLK: CD1.3(OUT) U4.15(TXC/REFCLK) U8.14(ERXCLK/#SS2A/U2BRX/#U2ACTS/PMA2/CN11/RG9)
PHY_RSTN: R33.1 U4.48(RST#) U8.1(AERXERR/RG15)
PHY_VDD_PLL: C54.1 C61.1 FB1.1 FB2.1 U4.47(VDDPLL)
PMD0: PMD.1 U8.93(PMD0/RE0)
PMD1: PMD.2 U8.94(PMD1/RE1)
PMD2: PMD.3 U8.98(PMD2/RE2)
PMD3: PMD.4 U8.99(PMD3/RE3)
PMD4: PMD.5 U8.100(PMD4/RE4)
PMD5: PMD.6 U8.3(PMD5/RE5)
PMD6: PMD.7 U8.4(PMD6/RE6)
PMD7: PMD.8 U8.5(PMD7/RE7)
PMRD: PMD.10 U8.82(PMRD/CN14/RD5)
PMWR: PMD.9 U8.81(OC5/PMWR/CN13/RD4)
RD1/VIDEO_SEL: PMD.13 R13.1 R28.2 U8.76(OC2/RD1)
RD10: PMD.14 U8.70(SCK1/IC3/PMCS2/PMA15/RD10)
RESET: C21.1 CON1.1 D2.A R8.2 R16.2 RST.2(S) U8.13(#MCLR) U11.RST
SCK: SD/MMC.5(CLK/SCLK) U8.48(AETXD1/SCK1A/U1BTX/#U1ARTS/CN21/RD15) U10.2(SCK) UEXT.9 UEXT_OPT.9
SCL1: R11.1 U8.66(AETXCLK/SCL1/INT3/RA14) U9.6(SCL) UEXT.5 UEXT_OPT.5
SD_#CS: R5.1 SD/MMC.2(CD/DAT3/CS) U8.96(TRD1/RG12)
SDA1: R12.1 U8.67(AETXEN/SDA1/INT4/RA15) U9.5(SDA) UEXT.6 UEXT_OPT.6
SOUND: R36.1 U8.78(OC4/RD3)
SPI_FLASH_CS: R70.1 U8.95(TRD2/RG14) U10.4(/CS/)
STNB_E: R47.2 U8.97(TRD0/RG13)
U3ARX: U8.49(SDA3A/SDI3A/U3ARX/PMA9/CN17/RF4) UEXT.4 UEXT_OPT.4
U3ATX: U8.50(SCL3A/SDO3A/U3ATX/PMA8/CN18/RF5) UEXT.3 UEXT_OPT.3
U3BRX: U6.12(R1OUT) U8.40(AC1RX/#SS3A/U3BRX/U3ACTS/RF12)
U3BTX: U6.11(T1IN) U8.39(AC1TX/SCK3A/U3BTX/#U3ARTS/RF13)
UEXT_#CS: R42.1 U8.47(AETXD0/#SS1A/U1BRX/#U1ACTS/CN20/RD14) UEXT.10 UEXT_OPT.10
USB_FAULT: R1.1 U1.2(#FLG) U8.9(T5CK/SDI1/RC4)
USB_ID: U8.51(USBID/RF3) USB-OTG.ID
USB_SHIELD: C9.2 USB-OTG.GND1 USB-OTG.GND2 USB-OTG.GND3 USB-OTG.GND4
V+: C37.1 C52.1 C59.1 C66.2 CD1.4(VDD) FET2.3(D) L3.1 LAN.AG LAN.AY PMD.17 R4.1 R6.2 R7.2 R11.2 R12.2 R13.2 R26.1 R33.2 R37.2 R38.2 R40.2 R42.2 R60.1 R61.1 R62.2 R69.1 R70.2 RM2.3.1 U4.7(VDDIO1) U4.24(VDDIO2) U6.16(VCC) U9.3(A2) U9.8(VCC) U10.5(/WP/) U10.6(VCC) UEXT.1 UEXT_OPT.1 ; supply symbol labelled 3.3V_E
VBAT: 3.7V-LI_BAT.1 C30.1 FET1.3(D) PMD.16 R31.2 U3.3(VBAT)
VBUSON: T1.1(B) U8.20(AN5/C1IN+/VBUSON/CN7/RB5)
VCC: C3.1 C4.1 C5.1 C12.2 C25.1 C26.1 C38.1 C43.1 C44.1 C45.1 C46.1 C47.1 C50.+ CON1.2 CON3.2 D2.C(K) GPIO.24 L2.1 R16.1 R17.1 R46.1 R52.1(1.1) U5.5 U8.2(VDD) U8.16(VDD) U8.37(VDD) U8.46(VDD) U8.55(VUSB) U8.62(VDD) U8.86(VDD) U11.3V3 VR1.3(VOUT) ; supply symbol labelled 3.3V
VCC/2: C53.2 C55.1 C56.1 C60.2 FB1.2 LAN.3(COM) R32.2 R43.2 R44.2 R48.2 R54.2 U4.31(VDDRX) U4.38(VDDRCV) U4.42(VDDTX) ; supply symbol labelled 2.5V
VDD: C6.1 C27.1 C28.1 L2.2 PMD.19 U8.30(AVDD) ; supply symbol labelled 3.3V_AVCC
VGA_GND [pwr]: R28.1 VGA_DB15-F.6
VGA_HSYNC: R3.2 R35.1 U8.77(OC3/RD2) VGA_DB15-F.13
VGA_VSYNC: U8.84(ETXCLK/PMD15/CN16/RD7) VGA_DB15-F.14
VIDEO: B_CLOSE.2 COMPOSITE_VIDEO.IO D7.A G_CLOSE.2 R34.2 R35.2 R_CLOSE.2
VIN: D3.A PWR_J.+ X1.1
Unconnected: CON3.6 PS2_KEYBOARD.2 PS2_KEYBOARD.6 PS2_KEYBOARD.NC1 PS2_KEYBOARD.NC2 RS232.1 RS232.4 RS232.6 RS232.9 U1.4(NC) U1.5(NC) U4.10(RXC) U4.29(LED3/NWAYEN) U4.34(FXSD/FXEN) U4.45(XO) U7.5(VREF) VGA_DB15-F.4 VGA_DB15-F.5 VGA_DB15-F.9 VGA_DB15-F.11 VGA_DB15-F.12 VGA_DB15-F.15

## Buses
D[0..13],AREF,A[0..2],A3/PGEC2,A4/PGED2,A5

## Notes on the sheet
- DTE Device!
- LAN | LEDS | CAN
- RS232
- KeyBoard | VGA connector | Audio Out
- Not Connected
- BUTTONS | MCU
- USB-OTG | ARDUINO_PLATFORM
- 3.3V
- +5V
- GND
- GND
- PIN1
- PIN2
- PIN3
- PIN4
- PIN5
- PIN6
- PIN11
- PIN12
- PIN13
- PIN14
- PIN15
- PIN16
- PIN17
- PIN18
- VOLTAGE REFERENCE
- PIN19
- PIN20
- PIN7
- PIN8
- PIN9
- PIN10
- GND
- 3.3V reference
- GND
- Fiducials:
- SD/MMC | UEXT
- POWER_SUPPLY
- 9-30VDC
- Battery Charger
- SPI FLASH MEMORY | EEPROM | Parallel Master Port
- +
- -
- appr. 70 mA charge current
- DuinoMite_eMega_Rev_B | DESIGNED BY: WWW.OLIMEX.COM/DEV, WWW.DONTRONICS.COM, WWW.KENSEGLERDESIGNS.COM | MADE IN BULGARIA
- Released under Creative Commons Attribution-Share Alike 3.0 United States License | Based on Maximite design by Geoff Graham http://geoffg.net/maximite.html

## Power pins joined to a net without a drawn wire
GND: VGA_DB15-F.GND1 VGA_DB15-F.GND2

## Library data of the parts
3.7V-LI_BAT = Penko:CON2
AUDIO1 CAN = gogo:JACK-3PIN
AUDIO2 COMPOSITE_VIDEO = OLIMEX_CONNECTORS:VIDEO_CINCH
B_CLOSE CAN_T CHG_D G_CLOSE R_CLOSE = jumper:SJ: SMD solder JUMPER
BUT RST = switch-omron:31-XX: OMRON SWITCH
C1-C15 C17 C19-C21 C23-C47 C52-C61 C63 C66 = rcl:C-EU: CAPACITOR, European symbol
C16 C18 C22 C48-C51 = rcl:CPOL-EU: POLARIZED CAPACITOR, European symbol
CD1 = gogo:6NC2_CLOCK_DRIVER
CON1-CON3 = Penko:CON6: CONNECTORS - 6 PINS
CON4 CON5 = Penko:CON8
CTS GND_PIN RTS = gogo:TESTPAD: drill 40mils, diameter 70mils
D1 D3 D5 D6 = gogo:SCHOTKKY7.62SS
D2 D7 = DOUBLE-SIDE:D: DIODES
D4 = OLIMEX_DISCRET:MMBZ5V6ALT1
FB1 FB2 L2 L3 = rcl:L-US: INDUCTOR, American symbol
FET1-FET3 = Penko:P-MOS+DIOD
FID1-FID3 = SparkFunEagle-6-6-07:FIDUCIAL: Fiducial Alignment Points Various fiducial points for machine vision alignment.
GPIO = con-harting-ml:ML26?E: HARTING
L1 = DOUBLE-SIDE:L
LAN = OLIMEX_CONNECTORS:RJLBC-060TC1
LED1 LED2 PWR_LED = DOUBLE-SIDE:LED
PGC1/PGC2 PGD1/PGD2 = jumper:SJ2W: SMD solder JUMPER
PMD = con-harting-ml:ML20: HARTING
PS2_KEYBOARD = OLIMEX_CONNECTORS:PS2
PWR_J = gogo:PWR-JAK
Q1 = crystal:HC49/S: CRYSTAL
Q2 = crystal:Q_GND
R1-R21 R23-R51 R53-R70 = rcl:R-EU_: RESISTOR, European symbol
R22 R52 = OLIMEX_DISCRET:R_0R
RM1 RM2 = OLIMEX_DISCRET:R_MATRIX_4E
RS232 = con-subd:M09HP: SUB-D
SD/MMC = OLIMEX_CONNECTORS:MICRO_SD/MMC
SR1 = OLIMEX_IC:TL431: TL431 Programmable Shunt Regulator Features: -> Programmable Output Voltage to 36 Volts -> Low Dynamic Output Impedance 0.20 Typical -> Sink Current Capability of 1.0 to 100mA -> Equivalent Full-Range Temperature Coefficient of 50ppm/°C Typical -> Temperature Compensated For Operation Over Full Rated Operating Temperature Range -> Low Output Noise Voltage -> Fast Turn-on Response
T1 = OLIMEX_DISCRET:DIGITAL_TRANSISTORS-NPN: DTC114YKA Digital Transistor - NPN
U1 = OLIMEX_IC:MIC2075
U2 = MPLAB_ICD2:MC34063A
U3 = OLIMEX_DISCRET:MCP7381X
U4 = OLIMEX_IC:KS8721BL: Ethernet PHY
U5 = OLIMEX_IC:USBLC6-2
U6 = gogo:MAX3232
U7 = arm:MCP2551
U8 = OLIMEX_IC:PIC32MX795F512L
U9 = gogo:24LCXX
U10 = IP4w:AT45DB041B_1
U11 = OLIMEX_CASES:PIC_PLATFORM_WITHOUT_ICSP
UEXT UEXT_OPT = con-harting-ml:ML10: HARTING
USB-OTG = OLIMEX_CONNECTORS:MINI_USB9
VGA_DB15-F = OLIMEX_CONNECTORS:DB15
VR1 VR2 = OLIMEX_DISCRET:MCP1700-REP
X1 = con-wago-500:W237-102: WAGO SCREW CLAMP

## Net classes
1 pwr: width 0.201 mm, drill 0.201 mm